# Altium project 数粒机发射板12通道.PrjPCB
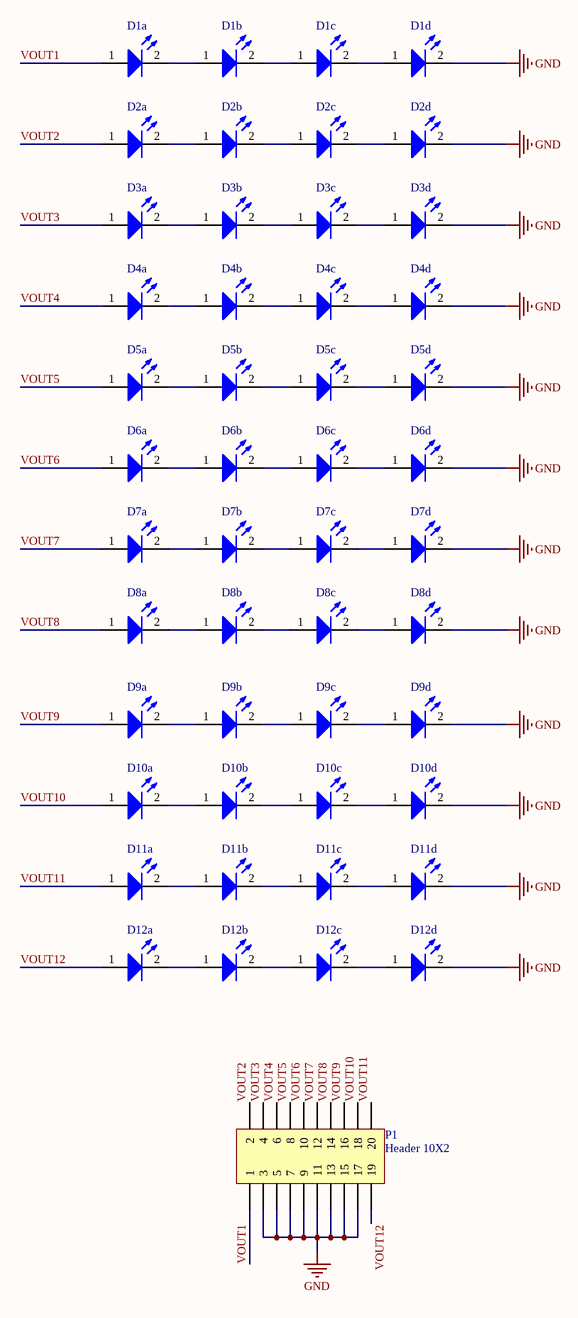
[diagram p0: 数粒机发射板12通道.SchDoc]
1 sheet, 49 parts. Net scope: global (net labels, ports and power ports of the same name join across sheets).
Board file: 数粒机发射板12通道.PcbDoc

## Sheet 数粒机发射板12通道.SchDoc
size A1

### Parts
D1a  红外接收珠子  [EL-1KL3]  (value not drawn)
D1b  红外接收珠子  [EL-1KL3]  (value not drawn)
D1c  红外接收珠子  [EL-1KL3]  (value not drawn)
D1d  红外接收珠子  [EL-1KL3]  (value not drawn)
D2a  红外接收珠子  [EL-1KL3]  (value not drawn)
D2b  红外接收珠子  [EL-1KL3]  (value not drawn)
D2c  红外接收珠子  [EL-1KL3]  (value not drawn)
D2d  红外接收珠子  [EL-1KL3]  (value not drawn)
D3a  红外接收珠子  [EL-1KL3]  (value not drawn)
D3b  红外接收珠子  [EL-1KL3]  (value not drawn)
D3c  红外接收珠子  [EL-1KL3]  (value not drawn)
D3d  红外接收珠子  [EL-1KL3]  (value not drawn)
D4a  红外接收珠子  [EL-1KL3]  (value not drawn)
D4b  红外接收珠子  [EL-1KL3]  (value not drawn)
D4c  红外接收珠子  [EL-1KL3]  (value not drawn)
D4d  红外接收珠子  [EL-1KL3]  (value not drawn)
D5a  红外接收珠子  [EL-1KL3]  (value not drawn)
D5b  红外接收珠子  [EL-1KL3]  (value not drawn)
D5c  红外接收珠子  [EL-1KL3]  (value not drawn)
D5d  红外接收珠子  [EL-1KL3]  (value not drawn)
D6a  红外接收珠子  [EL-1KL3]  (value not drawn)
D6b  红外接收珠子  [EL-1KL3]  (value not drawn)
D6c  红外接收珠子  [EL-1KL3]  (value not drawn)
D6d  红外接收珠子  [EL-1KL3]  (value not drawn)
D7a  红外接收珠子  [EL-1KL3]  (value not drawn)
D7b  红外接收珠子  [EL-1KL3]  (value not drawn)
D7c  红外接收珠子  [EL-1KL3]  (value not drawn)
D7d  红外接收珠子  [EL-1KL3]  (value not drawn)
D8a  红外接收珠子  [EL-1KL3]  (value not drawn)
D8b  红外接收珠子  [EL-1KL3]  (value not drawn)
D8c  红外接收珠子  [EL-1KL3]  (value not drawn)
D8d  红外接收珠子  [EL-1KL3]  (value not drawn)
D9a  红外接收珠子  [EL-1KL3]  (value not drawn)
D9b  红外接收珠子  [EL-1KL3]  (value not drawn)
D9c  红外接收珠子  [EL-1KL3]  (value not drawn)
D9d  红外接收珠子  [EL-1KL3]  (value not drawn)
D10a  红外接收珠子  [EL-1KL3]  (value not drawn)
D10b  红外接收珠子  [EL-1KL3]  (value not drawn)
D10c  红外接收珠子  [EL-1KL3]  (value not drawn)
D10d  红外接收珠子  [EL-1KL3]  (value not drawn)
D11a  红外接收珠子  [EL-1KL3]  (value not drawn)
D11b  红外接收珠子  [EL-1KL3]  (value not drawn)
D11c  红外接收珠子  [EL-1KL3]  (value not drawn)
D11d  红外接收珠子  [EL-1KL3]  (value not drawn)
D12a  红外接收珠子  [EL-1KL3]  (value not drawn)
D12b  红外接收珠子  [EL-1KL3]  (value not drawn)
D12c  红外接收珠子  [EL-1KL3]  (value not drawn)
D12d  红外接收珠子  [EL-1KL3]  (value not drawn)
P1  Header 10X2  [niujiaocha20p]

### Nets
GND: D1d.2(K) D2d.2(K) D3d.2(K) D4d.2(K) D5d.2(K) D6d.2(K) D7d.2(K) D8d.2(K) D9d.2(K) D10d.2(K) D11d.2(K) D12d.2(K) P1.3 P1.5 P1.7 P1.9 P1.11 P1.13 P1.15 P1.17
VOUT1: D1a.1(A) P1.1
VOUT2: D2a.1(A) P1.2
VOUT3: D3a.1(A) P1.4
VOUT4: D4a.1(A) P1.6
VOUT5: D5a.1(A) P1.8
VOUT6: D6a.1(A) P1.10
VOUT7: D7a.1(A) P1.12
VOUT8: D8a.1(A) P1.14
VOUT9: D9a.1(A) P1.16
VOUT10: D10a.1(A) P1.18
VOUT11: D11a.1(A) P1.20
VOUT12: D12a.1(A) P1.19
NetD1a_2: D1a.2(K) D1b.1(A)
NetD1b_2: D1b.2(K) D1c.1(A)
NetD1c_2: D1c.2(K) D1d.1(A)
NetD2a_2: D2a.2(K) D2b.1(A)
NetD2b_2: D2b.2(K) D2c.1(A)
NetD2c_2: D2c.2(K) D2d.1(A)
NetD3a_2: D3a.2(K) D3b.1(A)
NetD3b_2: D3b.2(K) D3c.1(A)
NetD3c_2: D3c.2(K) D3d.1(A)
NetD4a_2: D4a.2(K) D4b.1(A)
NetD4b_2: D4b.2(K) D4c.1(A)
NetD4c_2: D4c.2(K) D4d.1(A)
NetD5a_2: D5a.2(K) D5b.1(A)
NetD5b_2: D5b.2(K) D5c.1(A)
NetD5c_2: D5c.2(K) D5d.1(A)
NetD6a_2: D6a.2(K) D6b.1(A)
NetD6b_2: D6b.2(K) D6c.1(A)
NetD6c_2: D6c.2(K) D6d.1(A)
NetD7a_2: D7a.2(K) D7b.1(A)
NetD7b_2: D7b.2(K) D7c.1(A)
NetD7c_2: D7c.2(K) D7d.1(A)
NetD8a_2: D8a.2(K) D8b.1(A)
NetD8b_2: D8b.2(K) D8c.1(A)
NetD8c_2: D8c.2(K) D8d.1(A)
NetD9a_2: D9a.2(K) D9b.1(A)
NetD9b_2: D9b.2(K) D9c.1(A)
NetD9c_2: D9c.2(K) D9d.1(A)
NetD10a_2: D10a.2(K) D10b.1(A)
NetD10b_2: D10b.2(K) D10c.1(A)
NetD10c_2: D10c.2(K) D10d.1(A)
NetD11a_2: D11a.2(K) D11b.1(A)
NetD11b_2: D11b.2(K) D11c.1(A)
NetD11c_2: D11c.2(K) D11d.1(A)
NetD12a_2: D12a.2(K) D12b.1(A)
NetD12b_2: D12b.2(K) D12c.1(A)
NetD12c_2: D12c.2(K) D12d.1(A)

### Library data of the parts
D1a D1b D1c D1d D2a D2b D2c D2d D3a D3b D3c D3d D4a D4b D4c D4d D5a D5b D5c D5d D6a D6b D6c D6d D7a D7b D7c D7d D8a D8b D8c D8d D9a D9b D9c D9d D10a D10b D10c D10d D11a D11b D11c D11d D12a D12b D12c D12d = LED0: EL-1KL3; Published: 8-Jun-2000; LatestRevisionDate: 08-Jul-2005; LatestRevisionNote: Mech Layer 1 removed.; PackageReference: LED-0; Publisher: Altium Limited
P1 = Header 10X2: Header, 10-Pin, Dual row; LatestRevisionDate: 17-Jul-2002; LatestRevisionNote: Re-released for DXP Platform.; Publisher: Altium Limited